# Altium schematic sheet CAN.SchDoc
size A; SheetNumber: 3; SheetTotal: 4
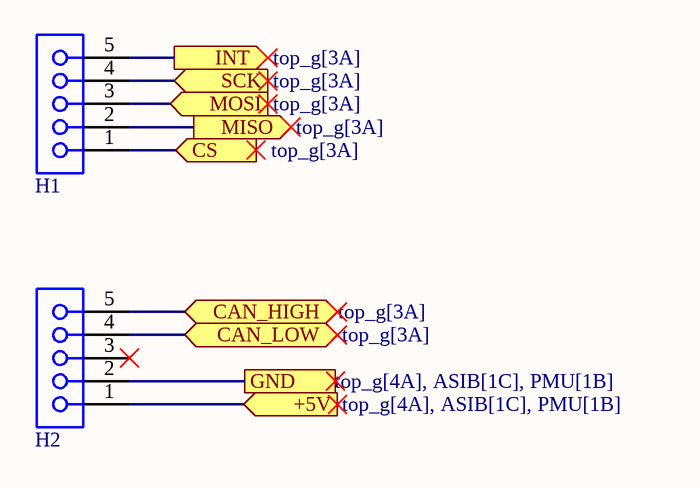
[diagram p0: CAN.SchDoc]

## Parts
H1  61300511821  [61300511821]  (value not drawn)
H2  61300511821  [61300511821]  (value not drawn)

## Ports
+5V (in, see top_g[4A], ASIB[1C], PMU[1B]), CAN_HIGH (bidir, see top_g[3A]), CAN_LOW (bidir, see top_g[3A]), CS (in, see top_g[3A]), GND (see top_g[4A], ASIB[1C], PMU[1B]), INT (out, see top_g[3A]), MISO (out, see top_g[3A]), MOSI (in, see top_g[3A]), SCK (in, see top_g[3A])

## Nets
+5V: H2.1 ; port +5V
CAN_HIGH: H2.5 ; port CAN_HIGH
CAN_LOW: H2.4 ; port CAN_LOW
CS: H1.1 ; port CS
GND: H2.2 ; port GND
INT: H1.5 ; port INT
MISO: H1.2 ; port MISO
MOSI: H1.3 ; port MOSI
SCK: H1.4 ; port SCK

Not connected (* = marked no-connect by the designer): H2 3*

## Library data of the parts
H1 H2 = 61300511821: WR-PHD Socket Header, THT, Vertical, pitch 2.54mm, 1 Row, 5P; Manufacturer: Wurth Elektronik; Contact Resistance: 20mOhm; Rated Current: 3A; Working Voltage: 250V; Withstanding Voltage: 500V; Manufacturer Part Number: 61300511821; Category: Board-to-Board Connectors; Match Code: WR-PHD; ComponentLink1Description: Website Link; ComponentLink1URL: https://www.we-online.com/redexpert/article/61300511821?ad; ComponentLink2Description: Datasheet Link; ComponentLink2URL: https://www.we-online.com/redexpert/spec/61300511821?ad; Mount: Through Hole; Operating Temperature Max: 125°C; Operating Temperature Min: -40°C; Packaging: Tray; Gender: Socket Header; Number of Pins: 5; Number of Rows: 1; Orientation: Vertical; Pitch: 2.54mm